# Altium schematic sheet WS2812B_Ring_Light.SchDoc
size A1
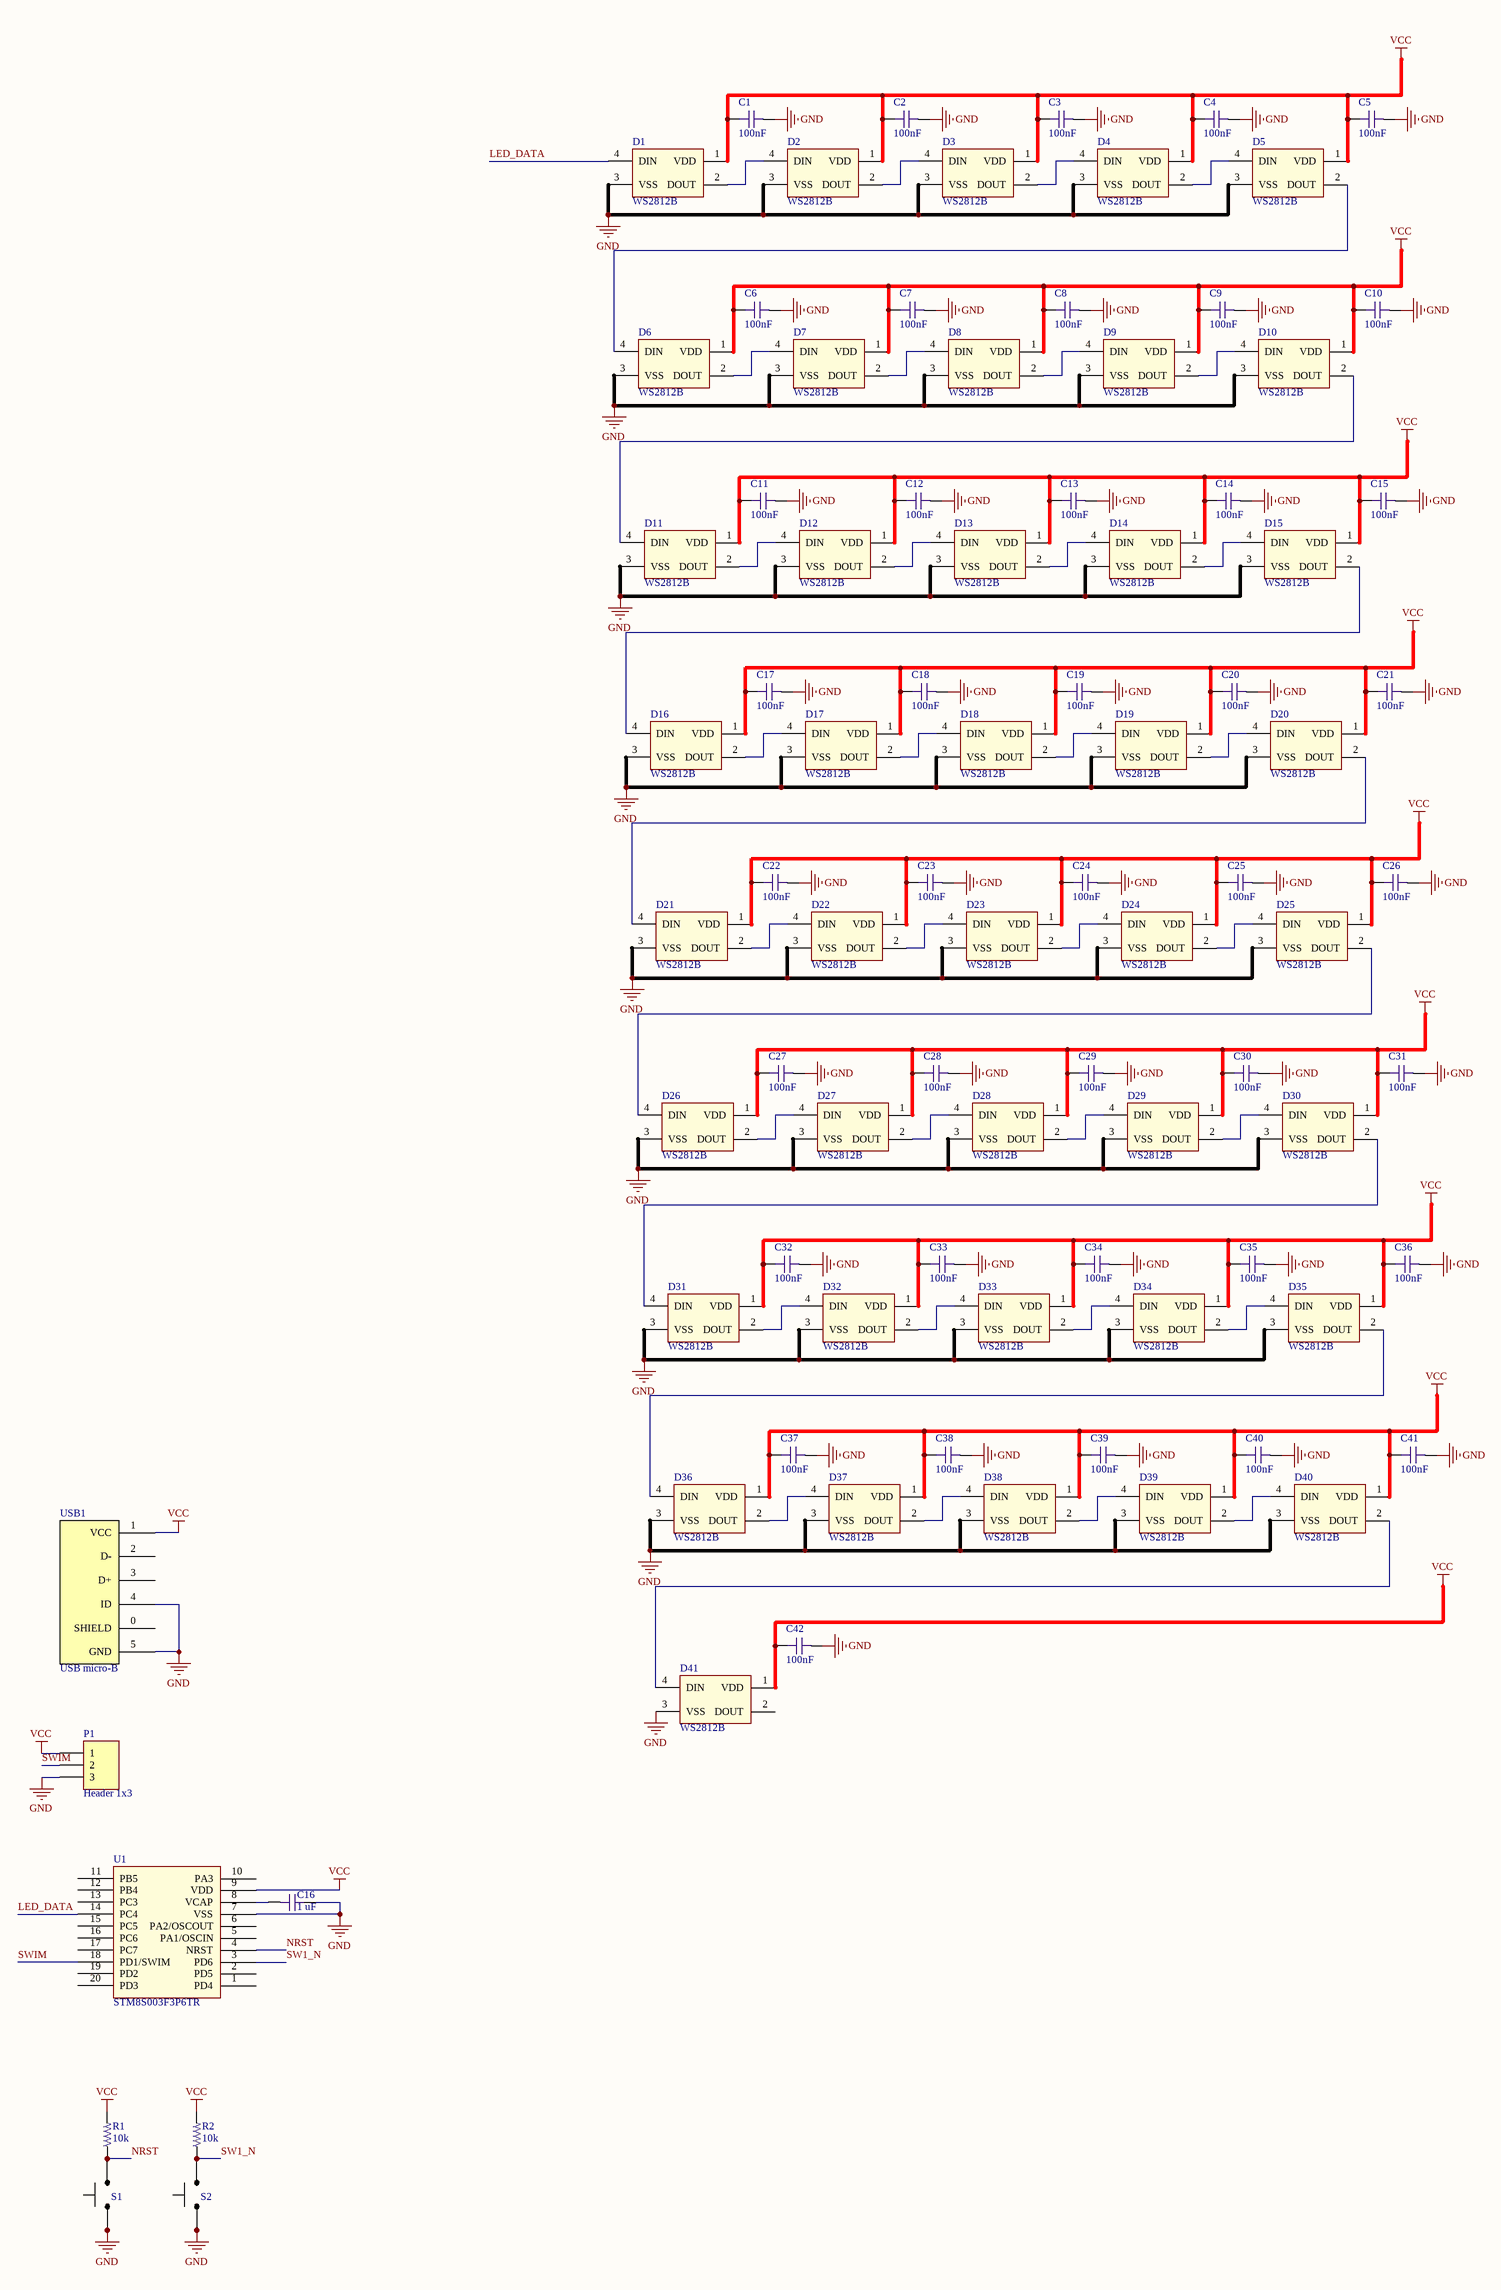
[diagram p0: WS2812B_Ring_Light.SchDoc]

## Parts
C1  value 100nF  [C0603-IPC]  (hidden comment: C0603 100nF 25V X7R)
C2  value 100nF  [C0603-IPC]  (hidden comment: C0603 100nF 25V X7R)
C3  value 100nF  [C0603-IPC]  (hidden comment: C0603 100nF 25V X7R)
C4  value 100nF  [C0603-IPC]  (hidden comment: C0603 100nF 25V X7R)
C5  value 100nF  [C0603-IPC]  (hidden comment: C0603 100nF 25V X7R)
C6  value 100nF  [C0603-IPC]  (hidden comment: C0603 100nF 25V X7R)
C7  value 100nF  [C0603-IPC]  (hidden comment: C0603 100nF 25V X7R)
C8  value 100nF  [C0603-IPC]  (hidden comment: C0603 100nF 25V X7R)
C9  value 100nF  [C0603-IPC]  (hidden comment: C0603 100nF 25V X7R)
C10  value 100nF  [C0603-IPC]  (hidden comment: C0603 100nF 25V X7R)
C11  value 100nF  [C0603-IPC]  (hidden comment: C0603 100nF 25V X7R)
C12  value 100nF  [C0603-IPC]  (hidden comment: C0603 100nF 25V X7R)
C13  value 100nF  [C0603-IPC]  (hidden comment: C0603 100nF 25V X7R)
C14  value 100nF  [C0603-IPC]  (hidden comment: C0603 100nF 25V X7R)
C15  value 100nF  [C0603-IPC]  (hidden comment: C0603 100nF 25V X7R)
C16  value 1 uF  [C0603-IPC]  (hidden comment: C0603 1uF 10V X7R)
C17  value 100nF  [C0603-IPC]  (hidden comment: C0603 100nF 25V X7R)
C18  value 100nF  [C0603-IPC]  (hidden comment: C0603 100nF 25V X7R)
C19  value 100nF  [C0603-IPC]  (hidden comment: C0603 100nF 25V X7R)
C20  value 100nF  [C0603-IPC]  (hidden comment: C0603 100nF 25V X7R)
C21  value 100nF  [C0603-IPC]  (hidden comment: C0603 100nF 25V X7R)
C22  value 100nF  [C0603-IPC]  (hidden comment: C0603 100nF 25V X7R)
C23  value 100nF  [C0603-IPC]  (hidden comment: C0603 100nF 25V X7R)
C24  value 100nF  [C0603-IPC]  (hidden comment: C0603 100nF 25V X7R)
C25  value 100nF  [C0603-IPC]  (hidden comment: C0603 100nF 25V X7R)
C26  value 100nF  [C0603-IPC]  (hidden comment: C0603 100nF 25V X7R)
C27  value 100nF  [C0603-IPC]  (hidden comment: C0603 100nF 25V X7R)
C28  value 100nF  [C0603-IPC]  (hidden comment: C0603 100nF 25V X7R)
C29  value 100nF  [C0603-IPC]  (hidden comment: C0603 100nF 25V X7R)
C30  value 100nF  [C0603-IPC]  (hidden comment: C0603 100nF 25V X7R)
C31  value 100nF  [C0603-IPC]  (hidden comment: C0603 100nF 25V X7R)
C32  value 100nF  [C0603-IPC]  (hidden comment: C0603 100nF 25V X7R)
C33  value 100nF  [C0603-IPC]  (hidden comment: C0603 100nF 25V X7R)
C34  value 100nF  [C0603-IPC]  (hidden comment: C0603 100nF 25V X7R)
C35  value 100nF  [C0603-IPC]  (hidden comment: C0603 100nF 25V X7R)
C36  value 100nF  [C0603-IPC]  (hidden comment: C0603 100nF 25V X7R)
C37  value 100nF  [C0603-IPC]  (hidden comment: C0603 100nF 25V X7R)
C38  value 100nF  [C0603-IPC]  (hidden comment: C0603 100nF 25V X7R)
C39  value 100nF  [C0603-IPC]  (hidden comment: C0603 100nF 25V X7R)
C40  value 100nF  [C0603-IPC]  (hidden comment: C0603 100nF 25V X7R)
C41  value 100nF  [C0603-IPC]  (hidden comment: C0603 100nF 25V X7R)
C42  value 100nF  [C0603-IPC]  (hidden comment: C0603 100nF 25V X7R)
D1  WS2812B  [WS2812B]
D2  WS2812B  [WS2812B]
D3  WS2812B  [WS2812B]
D4  WS2812B  [WS2812B]
D5  WS2812B  [WS2812B]
D6  WS2812B  [WS2812B]
D7  WS2812B  [WS2812B]
D8  WS2812B  [WS2812B]
D9  WS2812B  [WS2812B]
D10  WS2812B  [WS2812B]
D11  WS2812B  [WS2812B]
D12  WS2812B  [WS2812B]
D13  WS2812B  [WS2812B]
D14  WS2812B  [WS2812B]
D15  WS2812B  [WS2812B]
D16  WS2812B  [WS2812B]
D17  WS2812B  [WS2812B]
D18  WS2812B  [WS2812B]
D19  WS2812B  [WS2812B]
D20  WS2812B  [WS2812B]
D21  WS2812B  [WS2812B]
D22  WS2812B  [WS2812B]
D23  WS2812B  [WS2812B]
D24  WS2812B  [WS2812B]
D25  WS2812B  [WS2812B]
D26  WS2812B  [WS2812B]
D27  WS2812B  [WS2812B]
D28  WS2812B  [WS2812B]
D29  WS2812B  [WS2812B]
D30  WS2812B  [WS2812B]
D31  WS2812B  [WS2812B]
D32  WS2812B  [WS2812B]
D33  WS2812B  [WS2812B]
D34  WS2812B  [WS2812B]
D35  WS2812B  [WS2812B]
D36  WS2812B  [WS2812B]
D37  WS2812B  [WS2812B]
D38  WS2812B  [WS2812B]
D39  WS2812B  [WS2812B]
D40  WS2812B  [WS2812B]
D41  WS2812B  [WS2812B]
P1  Header 1x3  [HEADER 1X3 SMD 2.54mm]
R1  value 10k  [R0603-IPC]  (hidden comment: R0603 10K 1%)
R2  value 10k  [R0603-IPC]  (hidden comment: R0603 10K 1%)
S1  NRST  [TL3342F260QG]  (value not drawn)
S2  USER  [TL3342F260QG]  (value not drawn)
U1  STM8S003F3P6TR  [TSOP65P640X120-20N]
USB1  USB micro-B  [USB-MicroB]

## Nets
GND: C1.1 C2.1 C3.1 C4.1 C5.1 C6.1 C7.1 C8.1 C9.1 C10.1 C11.1 C12.1 C13.1 C14.1 C15.1 C16.2 C17.1 C18.1 C19.1 C20.1 C21.1 C22.1 C23.1 C24.1 C25.1 C26.1 C27.1 C28.1 C29.1 C30.1 C31.1 C32.1 C33.1 C34.1 C35.1 C36.1 C37.1 C38.1 C39.1 C40.1 C41.1 C42.1 D1.3(VSS) D2.3(VSS) D3.3(VSS) D4.3(VSS) D5.3(VSS) D6.3(VSS) D7.3(VSS) D8.3(VSS) D9.3(VSS) D10.3(VSS) D11.3(VSS) D12.3(VSS) D13.3(VSS) D14.3(VSS) D15.3(VSS) D16.3(VSS) D17.3(VSS) D18.3(VSS) D19.3(VSS) D20.3(VSS) D21.3(VSS) D22.3(VSS) D23.3(VSS) D24.3(VSS) D25.3(VSS) D26.3(VSS) D27.3(VSS) D28.3(VSS) D29.3(VSS) D30.3(VSS) D31.3(VSS) D32.3(VSS) D33.3(VSS) D34.3(VSS) D35.3(VSS) D36.3(VSS) D37.3(VSS) D38.3(VSS) D39.3(VSS) D40.3(VSS) D41.3(VSS) P1.3 S1.3 S1.4 S2.3 S2.4 U1.7(VSS) USB1.4(ID) USB1.5(GND)
VCC: C1.2 C2.2 C3.2 C4.2 C5.2 C6.2 C7.2 C8.2 C9.2 C10.2 C11.2 C12.2 C13.2 C14.2 C15.2 C17.2 C18.2 C19.2 C20.2 C21.2 C22.2 C23.2 C24.2 C25.2 C26.2 C27.2 C28.2 C29.2 C30.2 C31.2 C32.2 C33.2 C34.2 C35.2 C36.2 C37.2 C38.2 C39.2 C40.2 C41.2 C42.2 D1.1(VDD) D2.1(VDD) D3.1(VDD) D4.1(VDD) D5.1(VDD) D6.1(VDD) D7.1(VDD) D8.1(VDD) D9.1(VDD) D10.1(VDD) D11.1(VDD) D12.1(VDD) D13.1(VDD) D14.1(VDD) D15.1(VDD) D16.1(VDD) D17.1(VDD) D18.1(VDD) D19.1(VDD) D20.1(VDD) D21.1(VDD) D22.1(VDD) D23.1(VDD) D24.1(VDD) D25.1(VDD) D26.1(VDD) D27.1(VDD) D28.1(VDD) D29.1(VDD) D30.1(VDD) D31.1(VDD) D32.1(VDD) D33.1(VDD) D34.1(VDD) D35.1(VDD) D36.1(VDD) D37.1(VDD) D38.1(VDD) D39.1(VDD) D40.1(VDD) D41.1(VDD) P1.1 R1.2 R2.2 U1.9(VDD) USB1.1(VCC)
LED_DATA: D1.4(DIN) U1.14(PC4)
NRST: R1.1 S1.1 S1.2 U1.4(NRST)
SW1_N: R2.1 S2.1 S2.2 U1.3(PD6)
SWIM: P1.2 U1.18(PD1/SWIM)
NetC16_1: C16.1 U1.8(VCAP)
NetD1_2: D1.2(DOUT) D2.4(DIN)
NetD2_2: D2.2(DOUT) D3.4(DIN)
NetD3_2: D3.2(DOUT) D4.4(DIN)
NetD4_2: D4.2(DOUT) D5.4(DIN)
NetD5_2: D5.2(DOUT) D6.4(DIN)
NetD6_2: D6.2(DOUT) D7.4(DIN)
NetD7_2: D7.2(DOUT) D8.4(DIN)
NetD8_2: D8.2(DOUT) D9.4(DIN)
NetD9_2: D9.2(DOUT) D10.4(DIN)
NetD10_2: D10.2(DOUT) D11.4(DIN)
NetD11_2: D11.2(DOUT) D12.4(DIN)
NetD12_2: D12.2(DOUT) D13.4(DIN)
NetD13_2: D13.2(DOUT) D14.4(DIN)
NetD14_2: D14.2(DOUT) D15.4(DIN)
NetD15_2: D15.2(DOUT) D16.4(DIN)
NetD16_2: D16.2(DOUT) D17.4(DIN)
NetD17_2: D17.2(DOUT) D18.4(DIN)
NetD18_2: D18.2(DOUT) D19.4(DIN)
NetD19_2: D19.2(DOUT) D20.4(DIN)
NetD20_2: D20.2(DOUT) D21.4(DIN)
NetD21_2: D21.2(DOUT) D22.4(DIN)
NetD22_2: D22.2(DOUT) D23.4(DIN)
NetD23_2: D23.2(DOUT) D24.4(DIN)
NetD24_2: D24.2(DOUT) D25.4(DIN)
NetD25_2: D25.2(DOUT) D26.4(DIN)
NetD26_2: D26.2(DOUT) D27.4(DIN)
NetD27_2: D27.2(DOUT) D28.4(DIN)
NetD28_2: D28.2(DOUT) D29.4(DIN)
NetD29_2: D29.2(DOUT) D30.4(DIN)
NetD30_2: D30.2(DOUT) D31.4(DIN)
NetD31_2: D31.2(DOUT) D32.4(DIN)
NetD32_2: D32.2(DOUT) D33.4(DIN)
NetD33_2: D33.2(DOUT) D34.4(DIN)
NetD34_2: D34.2(DOUT) D35.4(DIN)
NetD35_2: D35.2(DOUT) D36.4(DIN)
NetD36_2: D36.2(DOUT) D37.4(DIN)
NetD37_2: D37.2(DOUT) D38.4(DIN)
NetD38_2: D38.2(DOUT) D39.4(DIN)
NetD39_2: D39.2(DOUT) D40.4(DIN)
NetD40_2: D40.2(DOUT) D41.4(DIN)

Not connected (* = marked no-connect by the designer): D41 2(DOUT); U1 1(PD4) 2(PD5) 5(PA1/OSCIN) 6(PA2/OSCOUT) 10(PA3) 11(PB5) 12(PB4) 13(PC3) 15(PC5) 16(PC6) 17(PC7) 19(PD2) 20(PD3); USB1 0(SHIELD) 2(D-) 3(D+)

## Library data of the parts
C1-C15 C17-C42 = C0603 100nF 25V X7R: Chip Capacitor, 0603, 100nF, 25V, X7R; EIA Code: X7R; Max. Voltage: 25V; Supplier 1: Digi-Key; Supplier Part Number 1: 490-1524-1-ND
C16 = C0603 1uF 10V X7R: Chip Capacitor, 0603, 1uF +/- 0.1uF, 10V, X7R; Supplier 1: Digi-Key; Supplier Part Number 1: 1276-1946-1-ND; Max. Voltage: 10V; EIA Code: X7R
D1-D41 = WS2812B: Addressable Lighting - Discrete Serial Red, Green, Blue (RGB) 5.00mm L x 5.00mm WS2812B; Supplier 1: Digi-Key; Supplier 3: LCSC; Supplier Part Number 2: 485-1655; Supplier Part Number 1: 1528-1104-ND; Supplier 2: Mouser; Supplier Part Number 3: C114586
P1 = Header 1x3: Header, 3-Pin; LatestRevisionDate: 17-Jul-2002; LatestRevisionNote: Re-released for DXP Platform.; Publisher: Altium Limited
R1 R2 = R0603 10K 1%: RES SMD 10K OHM 1% 1/10W 0603; Supplier 1: Digi-Key; Supplier Part Number 1: RMCF0603FT10K0CT-ND
S1 S2 = SWITCH TACTILE SPST: SWITCH TACTILE SPST-NO 0.05A 12V; Manufacturer Part Number: TL3342F260QG; Supplier 1: Digi-Key; Supplier Part Number 1: EG5470CT-ND
U1 = STM8S003F3P6TR: STM8 STM8S Microcontroller IC 8-Bit 16MHz 8KB (8K x 8) FLASH 20-TSSOP; Supplier 1: Digi-Key; Supplier 2: Mouser; Supplier 3: LCSC; Supplier Part Number 1: 497-18051-1-ND; Supplier Part Number 2: 511-STM8S003F3P6TR; Supplier Part Number 3: C52717
USB1 = USB micro-B: CONN RCPT USB TYPE B 3A; Manufacturer Part Number: 629105150521; Manufacturer: Wurth Electronics Inc.; Supplier 1: Digi-Key; Supplier Part Number 1: 609-4616-1-ND